# EAGLE design Noctua (EAGLE 9.6.1)
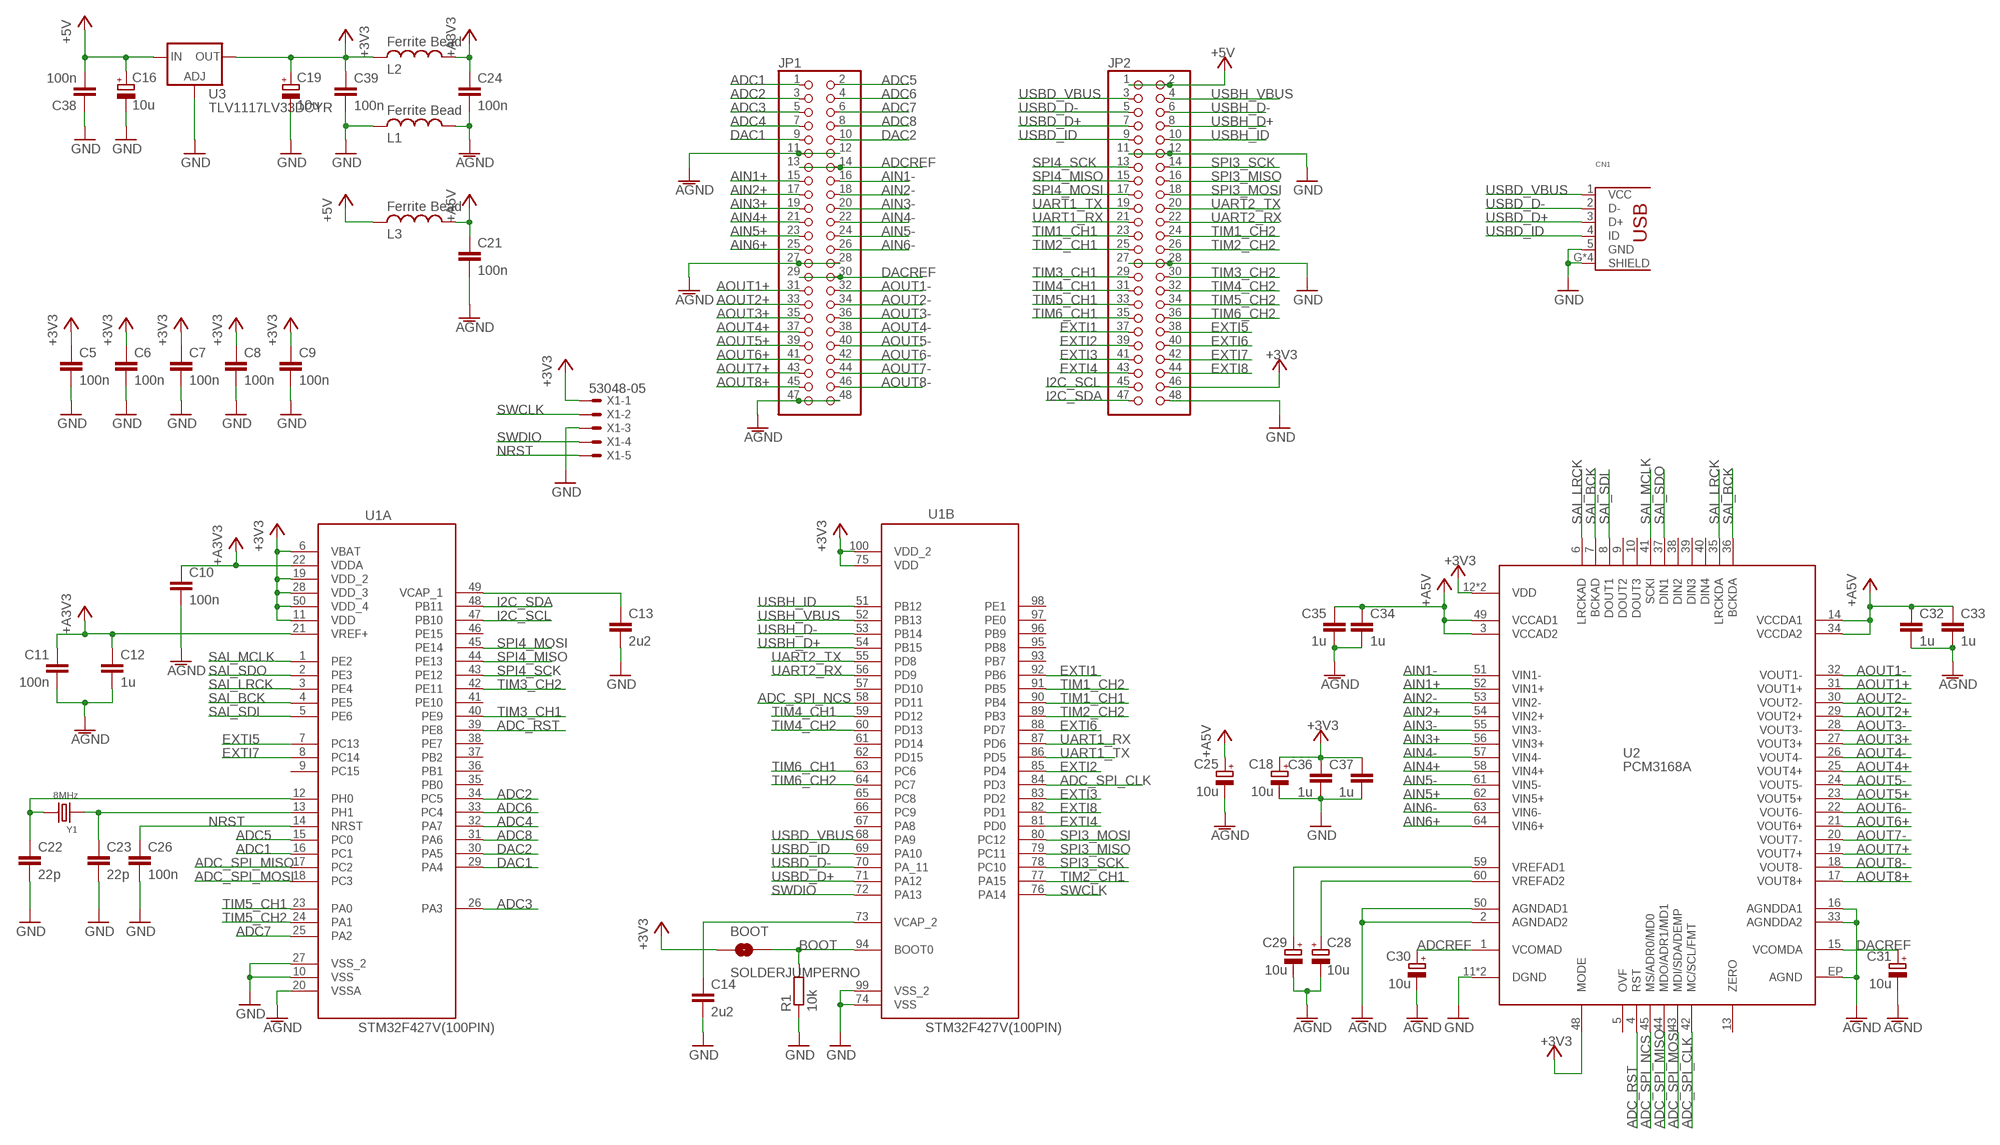
[diagram p0: schematic, sheet 1]

## Parts
BOOT  SOLDERJUMPERNO  [SJ_2S-NO]
C5  100n  C-EUC0603  [C0603]
C6  100n  C-EUC0603  [C0603]
C7  100n  C-EUC0603  [C0603]
C8  100n  C-EUC0603  [C0603]
C9  100n  C-EUC0603  [C0603]
C10  100n  C-EUC0603  [C0603]
C11  100n  C-EUC0603  [C0603]
C12  1u  C-EUC0603  [C0603]
C13  2u2  C-EUC0603  [C0603]
C14  2u2  C-EUC0603  [C0603]
C16  10u  CPOL-EUUD-4X5,8  [UD-4X5,8_NICHICON]
C18  10u  CPOL-EUUD-4X5,8  [UD-4X5,8_NICHICON]
C19  10u  CPOL-EUUD-4X5,8  [UD-4X5,8_NICHICON]
C21  100n  C-EUC0603  [C0603]
C22  22p  C-EUC0603  [C0603]
C23  22p  C-EUC0603  [C0603]
C24  100n  C-EUC0603  [C0603]
C25  10u  CPOL-EUUD-4X5,8  [UD-4X5,8_NICHICON]
C26  100n  C-EUC0603  [C0603]
C28  10u  CPOL-EUUD-4X5,8  [UD-4X5,8_NICHICON]
C29  10u  CPOL-EUUD-4X5,8  [UD-4X5,8_NICHICON]
C30  10u  CPOL-EUUD-4X5,8  [UD-4X5,8_NICHICON]
C31  10u  CPOL-EUUD-4X5,8  [UD-4X5,8_NICHICON]
C32  1u  C-EUC0603  [C0603]
C33  1u  C-EUC0603  [C0603]
C34  1u  C-EUC0603  [C0603]
C35  1u  C-EUC0603  [C0603]
C36  1u  C-EUC0603  [C0603]
C37  1u  C-EUC0603  [C0603]
C38  100n  C-EUC0603  [C0603]
C39  100n  C-EUC0603  [C0603]
CN1  USB_HRS_ZX62-B-5PA(11)MICRO.B  [HRS_ZX62RD-AB-5P8]
JP1  PINHD-2X24  [2X24]
JP2  PINHD-2X24  [2X24]
L1  Ferrite Bead  INDUCTOR  [0603]
L2  Ferrite Bead  INDUCTOR  [0603]
L3  Ferrite Bead  INDUCTOR  [0603]
R1  10k  R-EU_0603  [0603@1]
U1  STM32F427V(100PIN)  STM32F42XV/43XV(100PIN)  [QFP50P1600X1600X160-100N]
U2  PCM3168A  [PQFP64]
U3  TLV1117LV33DCYR  LD117AS33TR  [SOT223]
X1  53048-05  [53048-05]
Y1  8MHz  SMD-CRYSTAL-8MHZ-20PF-20PPM(2P-5.0X3.2MM)  [X2-SMD-5.0X3.2X1.3MM]

## Nets
+3V3: BOOT.1 C5.1 C6.1 C7.1 C8.1 C9.1 C18.+ C19.+ C36.1 C37.1 C39.1 JP2.46 L2.2 U1.6(A:VBAT) U1.11(A:VDD) U1.19(A:VDD_2) U1.28(A:VDD_3) U1.50(A:VDD_4) U1.75(B:VDD) U1.100(B:VDD_2) U2.12(VDD) U2.46(VDD) U2.48(MODE) U3.4(OUT) X1.1
+5V: C16.+ C38.2 JP2.1 JP2.2 L3.2 U3.3(IN)
+A3V3: C10.1 C11.1 C12.1 C24.1 L2.1 U1.21(A:VREF+) U1.22(A:VDDA)
+A5V: C21.1 C25.+ C32.1 C33.1 C34.1 C35.1 L3.1 U2.3(VCCAD2) U2.14(VCCDA1) U2.34(VCCDA2) U2.49(VCCAD1)
ADC1: JP1.1 U1.16(A:PC1)
ADC2: JP1.3 U1.34(A:PC5)
ADC3: JP1.5 U1.26(A:PA3)
ADC4: JP1.7 U1.32(A:PA7)
ADC5: JP1.2 U1.15(A:PC0)
ADC6: JP1.4 U1.33(A:PC4)
ADC7: JP1.6 U1.25(A:PA2)
ADC8: JP1.8 U1.31(A:PA6)
ADC_RST: U1.39(A:PE8) U2.4(RST)
ADC_SPI_CLK: U1.84(B:PD3) U2.42(MC/SCL/FMT)
ADC_SPI_MISO: U1.17(A:PC2) U2.44(MDO/ADR1/MD1)
ADC_SPI_MOSI: U1.18(A:PC3) U2.43(MDI/SDA/DEMP)
ADC_SPI_NCS: U1.58(B:PD11) U2.45(MS/ADR0/MD0)
ADCREF: C30.+ JP1.13 JP1.14 U2.1(VCOMAD)
AGND: C10.2 C11.2 C12.2 C21.2 C24.2 C25.- C28.- C29.- C30.- C31.- C32.2 C33.2 C34.2 C35.2 JP1.11 JP1.12 JP1.27 JP1.28 JP1.47 JP1.48 L1.1 U1.20(A:VSSA) U2.2(AGNDAD2) U2.16(AGNDDA1) U2.33(AGNDDA2) U2.50(AGNDAD1) U2.EP(AGND)
AIN1+: JP1.15 U2.52(VIN1+)
AIN1-: JP1.16 U2.51(VIN1-)
AIN2+: JP1.17 U2.54(VIN2+)
AIN2-: JP1.18 U2.53(VIN2-)
AIN3+: JP1.19 U2.56(VIN3+)
AIN3-: JP1.20 U2.55(VIN3-)
AIN4+: JP1.21 U2.58(VIN4+)
AIN4-: JP1.22 U2.57(VIN4-)
AIN5+: JP1.23 U2.62(VIN5+)
AIN5-: JP1.24 U2.61(VIN5-)
AIN6+: JP1.25 U2.64(VIN6+)
AIN6-: JP1.26 U2.63(VIN6-)
AOUT1+: JP1.31 U2.31(VOUT1+)
AOUT1-: JP1.32 U2.32(VOUT1-)
AOUT2+: JP1.33 U2.29(VOUT2+)
AOUT2-: JP1.34 U2.30(VOUT2-)
AOUT3+: JP1.35 U2.27(VOUT3+)
AOUT3-: JP1.36 U2.28(VOUT3-)
AOUT4+: JP1.37 U2.25(VOUT4+)
AOUT4-: JP1.38 U2.26(VOUT4-)
AOUT5+: JP1.39 U2.23(VOUT5+)
AOUT5-: JP1.40 U2.24(VOUT5-)
AOUT6+: JP1.41 U2.21(VOUT6+)
AOUT6-: JP1.42 U2.22(VOUT6-)
AOUT7+: JP1.43 U2.19(VOUT7+)
AOUT7-: JP1.44 U2.20(VOUT7-)
AOUT8+: JP1.45 U2.17(VOUT8+)
AOUT8-: JP1.46 U2.18(VOUT8-)
BOOT: BOOT.2 R1.2 U1.94(B:BOOT0)
DAC1: JP1.9 U1.29(A:PA4)
DAC2: JP1.10 U1.30(A:PA5)
DACREF: C31.+ JP1.29 JP1.30 U2.15(VCOMDA)
EXTI1: JP2.37 U1.92(B:PB6)
EXTI2: JP2.39 U1.85(B:PD4)
EXTI3: JP2.41 U1.83(B:PD2)
EXTI4: JP2.43 U1.81(B:PD0)
EXTI5: JP2.38 U1.7(A:PC13)
EXTI6: JP2.40 U1.88(B:PD7)
EXTI7: JP2.42 U1.8(A:PC14)
EXTI8: JP2.44 U1.82(B:PD1)
GND: C5.2 C6.2 C7.2 C8.2 C9.2 C13.2 C14.2 C16.- C18.- C19.- C22.2 C23.2 C26.2 C36.2 C37.2 C38.1 C39.2 CN1.5(GND) CN1.G2(SHIELD) CN1.G3(SHIELD) CN1.G4(SHIELD) CN1.G(SHIELD) JP2.11 JP2.12 JP2.27 JP2.28 JP2.48 L1.2 R1.1 U1.10(A:VSS) U1.27(A:VSS_2) U1.74(B:VSS) U1.99(B:VSS_2) U2.11(DGND) U2.47(DGND) U3.1(ADJ) X1.3
I2C_SCL: JP2.45 U1.47(A:PB10)
I2C_SDA: JP2.47 U1.48(A:PB11)
N$2: C28.+ U2.60(VREFAD2)
N$11: C13.1 U1.49(A:VCAP_1)
N$12: C23.1 U1.13(A:PH1) Y1.1
N$15: C22.1 U1.12(A:PH0) Y1.2
N$17: C14.1 U1.73(B:VCAP_2)
NRST: C26.1 U1.14(A:NRST) X1.5
SAI_BCK: U1.4(A:PE5) U2.7(BCKAD) U2.36(BCKDA)
SAI_LRCK: U1.3(A:PE4) U2.6(LRCKAD) U2.35(LRCKDA)
SAI_MCLK: U1.1(A:PE2) U2.41(SCKI)
SAI_SDI: U1.5(A:PE6) U2.8(DOUT1)
SAI_SDO: U1.2(A:PE3) U2.37(DIN1)
SPI3_MISO: JP2.16 U1.79(B:PC11)
SPI3_MOSI: JP2.18 U1.80(B:PC12)
SPI3_SCK: JP2.14 U1.78(B:PC10)
SPI4_MISO: JP2.15 U1.44(A:PE13)
SPI4_MOSI: JP2.17 U1.45(A:PE14)
SPI4_SCK: JP2.13 U1.43(A:PE12)
SWCLK: U1.76(B:PA14) X1.2
SWDIO: U1.72(B:PA13) X1.4
TIM1_CH1: JP2.23 U1.90(B:PB4)
TIM1_CH2: JP2.24 U1.91(B:PB5)
TIM2_CH1: JP2.25 U1.77(B:PA15)
TIM2_CH2: JP2.26 U1.89(B:PB3)
TIM3_CH1: JP2.29 U1.40(A:PE9)
TIM3_CH2: JP2.30 U1.42(A:PE11)
TIM4_CH1: JP2.31 U1.59(B:PD12)
TIM4_CH2: JP2.32 U1.60(B:PD13)
TIM5_CH1: JP2.33 U1.23(A:PA0)
TIM5_CH2: JP2.34 U1.24(A:PA1)
TIM6_CH1: JP2.35 U1.63(B:PC6)
TIM6_CH2: JP2.36 U1.64(B:PC7)
UART1_RX: JP2.21 U1.87(B:PD6)
UART1_TX: JP2.19 U1.86(B:PD5)
UART2_RX: JP2.22 U1.56(B:PD9)
UART2_TX: JP2.20 U1.55(B:PD8)
USBD_D+: CN1.3(D+) JP2.7 U1.71(B:PA12)
USBD_D-: CN1.2(D-) JP2.5 U1.70(B:PA_11)
USBD_ID: CN1.4(ID) JP2.9 U1.69(B:PA10)
USBD_VBUS: CN1.1(VCC) JP2.3 U1.68(B:PA9)
USBH_D+: JP2.8 U1.54(B:PB15)
USBH_D-: JP2.6 U1.53(B:PB14)
USBH_ID: JP2.10 U1.51(B:PB12)
USBH_VBUS: JP2.4 U1.52(B:PB13)
VREF_ADC: C29.+ U2.59(VREFAD1)
Unconnected: U1.9(A:PC15) U1.35(A:PB0) U1.36(A:PB1) U1.37(A:PB2) U1.38(A:PE7) U1.41(A:PE10) U1.46(A:PE15) U1.57(B:PD10) U1.61(B:PD14) U1.62(B:PD15) U1.65(B:PC8) U1.66(B:PC9) U1.67(B:PA8) U1.93(B:PB7) U1.95(B:PB8) U1.96(B:PB9) U1.97(B:PE0) U1.98(B:PE1) U2.5(OVF) U2.9(DOUT2) U2.10(DOUT3) U2.13(ZERO) U2.38(DIN2) U2.39(DIN3) U2.40(DIN4)

## Library data of the parts
BOOT = SparkFun:SOLDERJUMPER: Solder Jumper Standard SMD solder jumper. Used to automate production. Two varients : Normally Open and Normally Closed are the same, but have different paste layers. NC will have a large amount of paste and should jumper during reflow.
C5-C14 C21-C24 C26 C32-C39 = Rebel:C-EU: CAPACITOR, European symbol
C16 C18 C19 C25 C28-C31 = Rebel:CPOL-EU: POLARIZED CAPACITOR, European symbol
CN1 = Rebel:USB_HRS_ZX62-B-5PA(11)MICRO.B
JP1 JP2 = pinhead:PINHD-2X24: PIN HEADER
L1-L3 = Rebel:INDUCTOR; OC_FARNELL: 2288736
R1 = Rebel:R-EU_: RESISTOR, European symbol
U1 = Rebel:STM32F42XV/43XV(100PIN): STM32F746VGT6
U2 = Rebel:PCM3168A
U3 = v-reg:LD117A?*: Low drop fixed and adjustable positive voltage regulators 1 A Source: http://www.st.com/stonline/products/literature/ds/7194/ld1117axx.pdf
X1 = con-molex:53?-05: CONNECTOR wire to board 1.25 mm (.049 inch) pitch header; MF: MOLEX; MPN: 53048-0510; OC_FARNELL: 9732926; OC_NEWARK: 57H4722
Y1 = Seeed-OPL-crystal-osctllator:SMD-CRYSTAL-8MHZ-20PF-20PPM(2P-5.0X3.2MM): 306010004; MPN: 5032/2P; VALUE: 5032/2p

## Net classes
1 power: width 0.178 mm, drill 0.305 mm, clearance 0.178 mm to class 0, clearance 0.178 mm

## Board
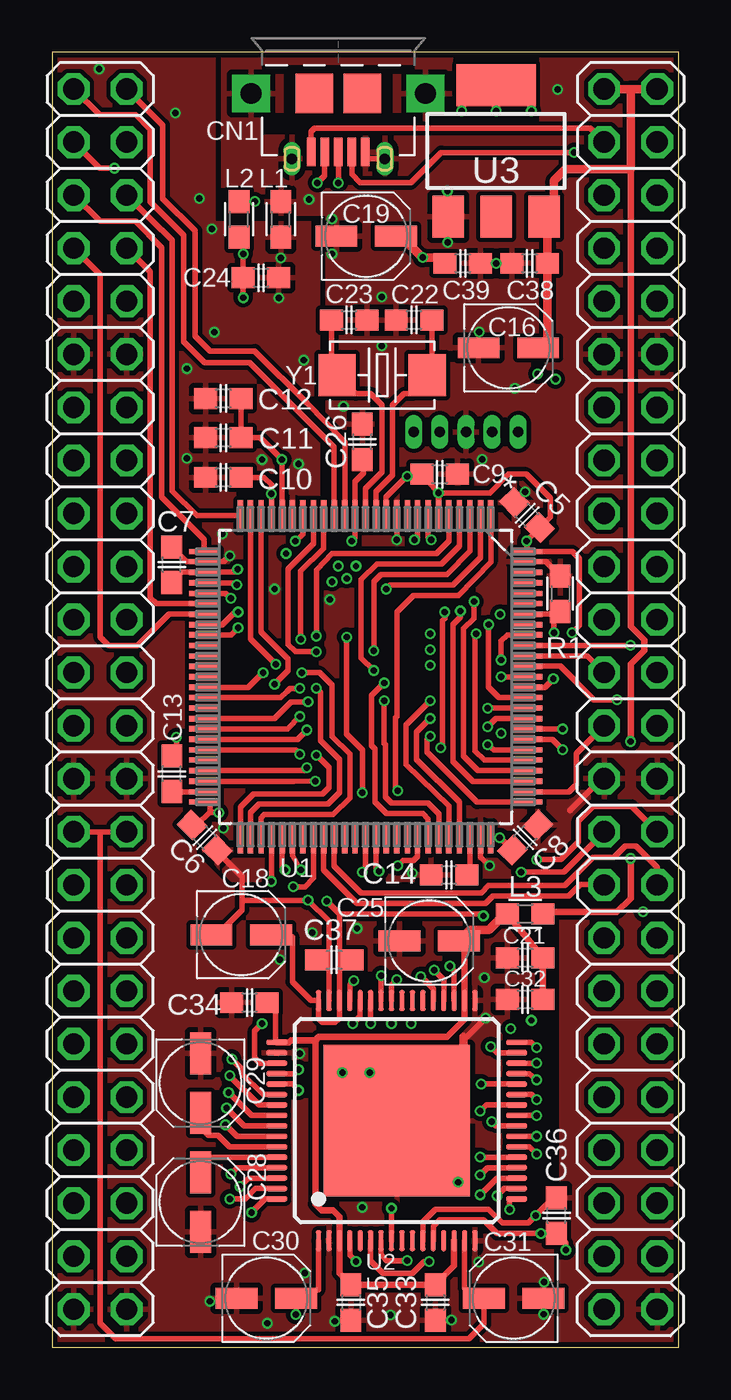
[diagram p1: board, top side]
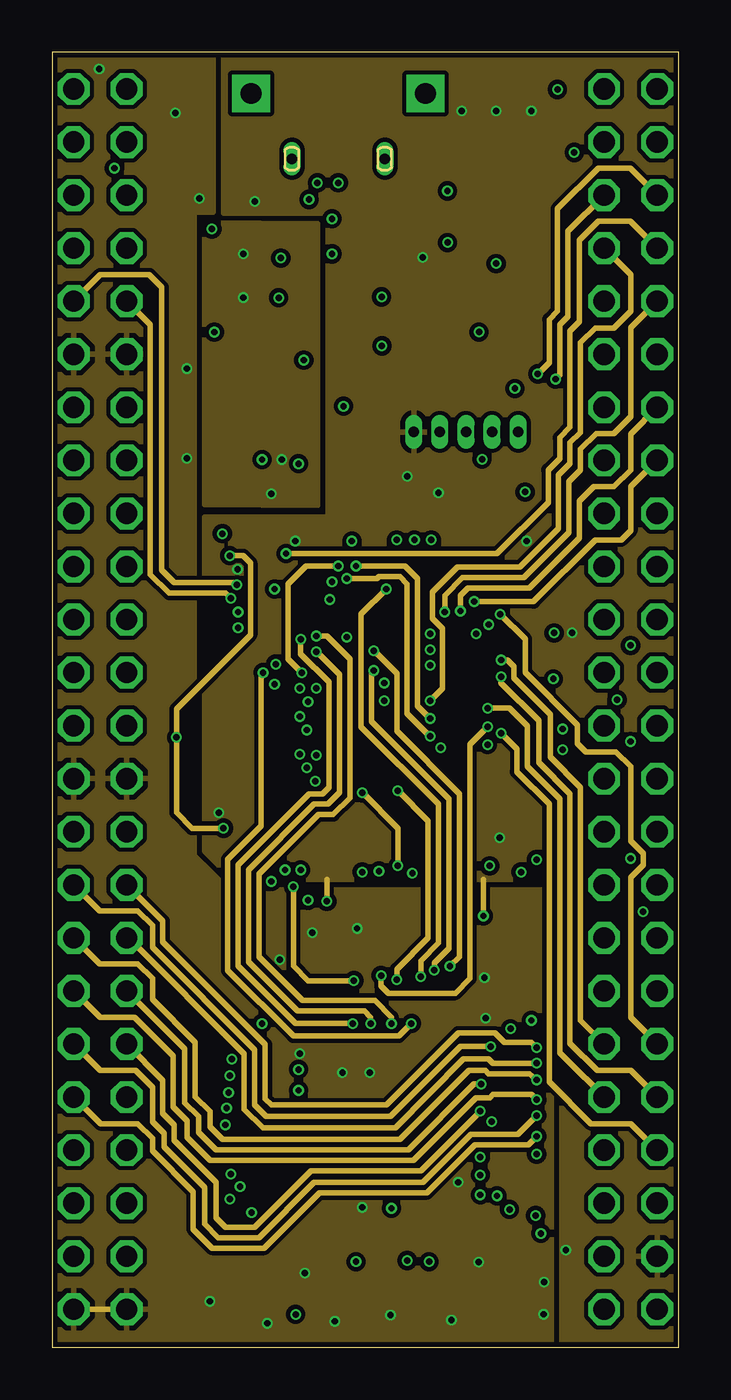
[diagram p2: board, inner layer InnerTop]
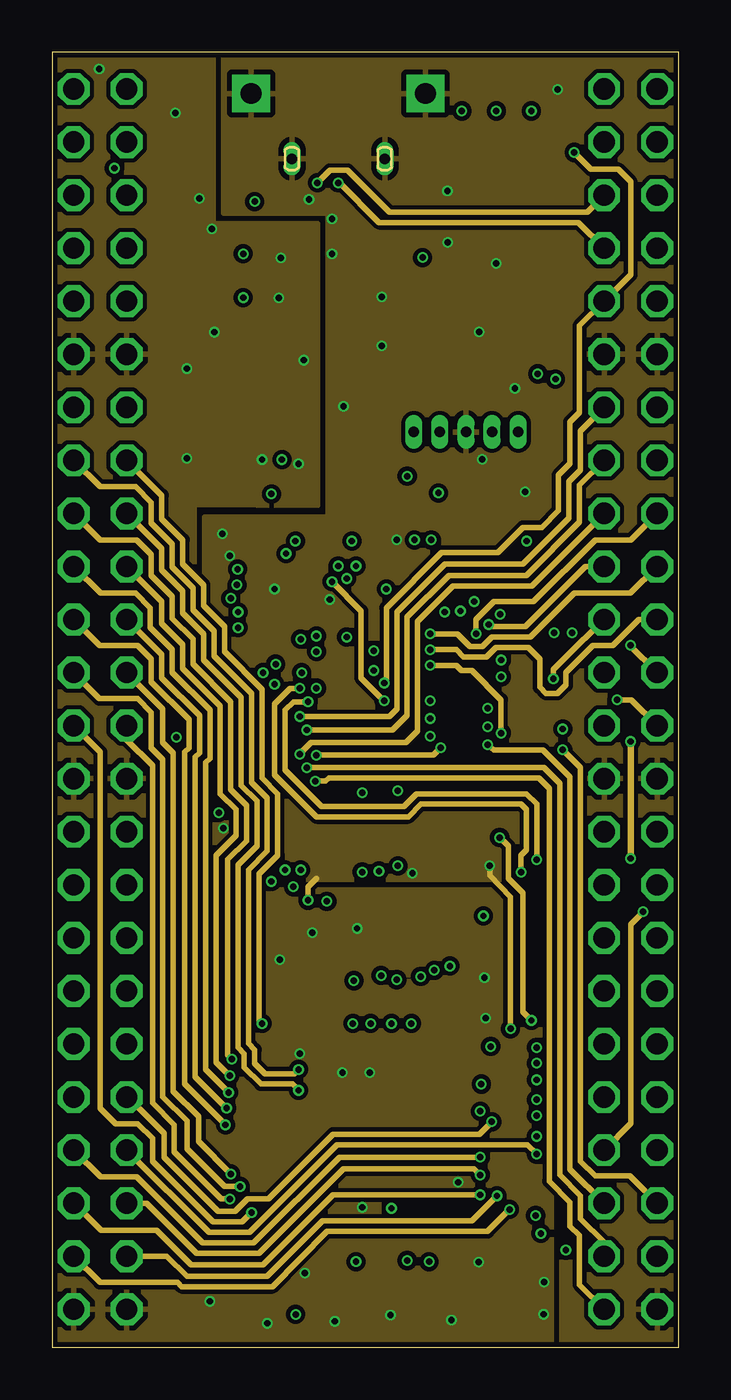
[diagram p3: board, inner layer InnerBottom]
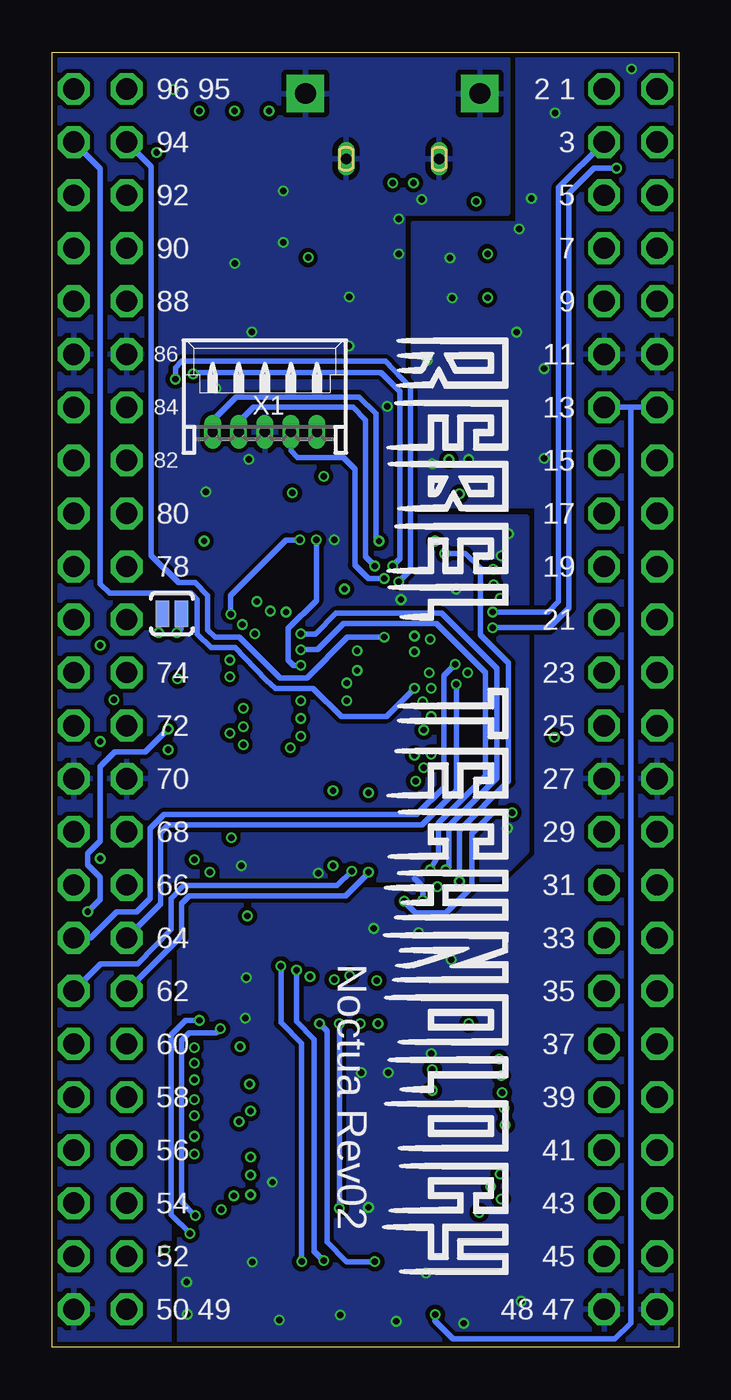
[diagram p4: board, bottom side, seen from below]

Size 30 x 62 mm. Coordinates in mm from the lower left corner, seen from the top.
Outline: 0,0 30,0 30,62 0,62 0,0
Copper layers (1*2*15*16): Top 0.035mm / dielectric 0.2mm / InnerTop 0.0175mm / dielectric 0.3mm / InnerBottom 0.0175mm / dielectric 0.2mm / Bottom 0.035mm
Design rules "SeeedStudio_4layer_DRU_no_angle_20140221 *": minimum track width 8mil, minimum drill 12mil, track to track 8mil, track to pad 8mil, pad to pad 8mil, via to via 8mil, smd to smd 0mil, copper to edge 10mil, drill to drill 8mil, minimum pad ring 6mil, minimum via ring 4mil, stop-mask expansion 4mil, vias tented up to drill 25mil, thermal gap 10mil

### Footprints (pad centres in the part's own frame; a part is rotated, then mirrored left to right if it is on the bottom)
SJ_2S-NO = smd 0.635 x 1.27: 1 -0.45,0; 2 0.45,0
C0603 = smd 1.1 x 1: 1 -0.85,0; 2 0.85,0
UD-4X5,8_NICHICON = smd 2 x 1: + 1.425,0; - -1.425,0
HRS_ZX62RD-AB-5P8 = smd 0.4 x 1.35: 1 1.3,2.275; 2 0.65,2.275; 3 0,2.275; 4 -0.65,2.275; 5 -1.3,2.275 | smd 1.8 x 1.9: D_0 -1.15,-0.525; D_1 1.15,-0.525 | drill 1 pad 1.8 square: G -4.175,-0.525; G2 4.175,-0.525 | drill 0.5 long: G3 -2.225,2.6; G4 2.225,2.6
2X24 = drill 1.016 octagon: 1 -27.94,-1.27; 2 -27.94,1.27; 3 -25.4,-1.27; 4 -25.4,1.27; 5 -22.86,-1.27; 6 -22.86,1.27; 7 -20.32,-1.27; 8 -20.32,1.27; 9 -17.78,-1.27; 10 -17.78,1.27; 11 -15.24,-1.27; 12 -15.24,1.27; 13 -12.7,-1.27; 14 -12.7,1.27; 15 -10.16,-1.27; 16 -10.16,1.27; 17 -7.62,-1.27; 18 -7.62,1.27; 19 -5.08,-1.27; 20 -5.08,1.27; 21 -2.54,-1.27; 22 -2.54,1.27; 23 0,-1.27; 24 0,1.27; 25 2.54,-1.27; 26 2.54,1.27; 27 5.08,-1.27; 28 5.08,1.27; 29 7.62,-1.27; 30 7.62,1.27; 31 10.16,-1.27; 32 10.16,1.27; 33 12.7,-1.27; 34 12.7,1.27; 35 15.24,-1.27; 36 15.24,1.27; 37 17.78,-1.27; 38 17.78,1.27; 39 20.32,-1.27; 40 20.32,1.27; 41 22.86,-1.27; 42 22.86,1.27; 43 25.4,-1.27; 44 25.4,1.27; 45 27.94,-1.27; 46 27.94,1.27; 47 30.48,-1.27; 48 30.48,1.27
0603 = smd 1.1 x 1: 1 -0.85,0; 2 0.85,0
0603@1 = smd 1.1 x 1: 1 -0.85,0; 2 0.85,0
QFP50P1600X1600X160-100N = smd 1.473 x 0.254: 1 -7.722,5.994; 2 -7.722,5.512; 3 -7.722,5.004; 4 -7.722,4.496; 5 -7.722,3.988; 6 -7.722,3.505; 7 -7.722,2.997; 8 -7.722,2.489; 9 -7.722,2.007; 10 -7.722,1.499; 11 -7.722,0.991; 12 -7.722,0.508; 13 -7.722,0; 14 -7.722,-0.508; 15 -7.722,-0.991; 16 -7.722,-1.499; 17 -7.722,-2.007; 18 -7.722,-2.489; 19 -7.722,-2.997; 20 -7.722,-3.505; 21 -7.722,-3.988; 22 -7.722,-4.496; 23 -7.722,-5.004; 24 -7.722,-5.512; 25 -7.722,-5.994; 51 7.722,-5.994; 52 7.722,-5.512; 53 7.722,-5.004; 54 7.722,-4.496; 55 7.722,-3.988; 56 7.722,-3.505; 57 7.722,-2.997; 58 7.722,-2.489; 59 7.722,-2.007; 60 7.722,-1.499; 61 7.722,-0.991; 62 7.722,-0.508; 63 7.722,0; 64 7.722,0.508; 65 7.722,0.991; 66 7.722,1.499; 67 7.722,2.007; 68 7.722,2.489; 69 7.722,2.997; 70 7.722,3.505; 71 7.722,3.988; 72 7.722,4.496; 73 7.722,5.004; 74 7.722,5.512; 75 7.722,5.994 | smd 0.254 x 1.473: 26 -5.994,-7.722; 27 -5.512,-7.722; 28 -5.004,-7.722; 29 -4.496,-7.722; 30 -3.988,-7.722; 31 -3.505,-7.722; 32 -2.997,-7.722; 33 -2.489,-7.722; 34 -2.007,-7.722; 35 -1.499,-7.722; 36 -0.991,-7.722; 37 -0.508,-7.722; 38 0,-7.722; 39 0.508,-7.722; 40 0.991,-7.722; 41 1.499,-7.722; 42 2.007,-7.722; 43 2.489,-7.722; 44 2.997,-7.722; 45 3.505,-7.722; 46 3.988,-7.722; 47 4.496,-7.722; 48 5.004,-7.722; 49 5.512,-7.722; 50 5.994,-7.722; 76 5.994,7.722; 77 5.512,7.722; 78 5.004,7.722; 79 4.496,7.722; 80 3.988,7.722; 81 3.505,7.722; 82 2.997,7.722; 83 2.489,7.722; 84 2.007,7.722; 85 1.499,7.722; 86 0.991,7.722; 87 0.508,7.722; 88 0,7.722; 89 -0.508,7.722; 90 -0.991,7.722; 91 -1.499,7.722; 92 -2.007,7.722; 93 -2.489,7.722; 94 -2.997,7.722; 95 -3.505,7.722; 96 -3.988,7.722; 97 -4.496,7.722; 98 -5.004,7.722; 99 -5.512,7.722; 100 -5.994,7.722
PQFP64 = smd 0.25 x 1: 1 -3.75,-5.75; 2 -3.25,-5.75; 3 -2.75,-5.75; 4 -2.25,-5.75; 5 -1.75,-5.75; 6 -1.25,-5.75; 7 -0.75,-5.75; 8 -0.25,-5.75; 9 0.25,-5.75; 10 0.75,-5.75; 11 1.25,-5.75; 12 1.75,-5.75; 13 2.25,-5.75; 14 2.75,-5.75; 15 3.25,-5.75; 16 3.75,-5.75; 33 3.75,5.75; 34 3.25,5.75; 35 2.75,5.75; 36 2.25,5.75; 37 1.75,5.75; 38 1.25,5.75; 39 0.75,5.75; 40 0.25,5.75; 41 -0.25,5.75; 42 -0.75,5.75; 43 -1.25,5.75; 44 -1.75,5.75; 45 -2.25,5.75; 46 -2.75,5.75; 47 -3.25,5.75; 48 -3.75,5.75 | smd 1 x 0.25: 17 5.75,-3.75; 18 5.75,-3.25; 19 5.75,-2.75; 20 5.75,-2.25; 21 5.75,-1.75; 22 5.75,-1.25; 23 5.75,-0.75; 24 5.75,-0.25; 25 5.75,0.25; 26 5.75,0.75; 27 5.75,1.25; 28 5.75,1.75; 29 5.75,2.25; 30 5.75,2.75; 31 5.75,3.25; 32 5.75,3.75; 49 -5.75,3.75; 50 -5.75,3.25; 51 -5.75,2.75; 52 -5.75,2.25; 53 -5.75,1.75; 54 -5.75,1.25; 55 -5.75,0.75; 56 -5.75,0.25; 57 -5.75,-0.25; 58 -5.75,-0.75; 59 -5.75,-1.25; 60 -5.75,-1.75; 61 -5.75,-2.25; 62 -5.75,-2.75; 63 -5.75,-3.25; 64 -5.75,-3.75 | smd 7 x 7.26: EP 0,0
SOT223 = smd 1.5 x 2: 1 -2.3,-3.15; 2 0,-3.15; 3 2.3,-3.15 | smd 3.8 x 2: 4 0,3.15
53048-05 = drill 0.5 pad 0.698 long: 1 2.5,-1.25; 2 1.25,-1.25; 3 0,-1.25; 4 -1.25,-1.25; 5 -2.5,-1.25
X2-SMD-5.0X3.2X1.3MM = smd 1.778 x 2.032: 1 -2.159,0; 2 2.159,0

### Placement (x,y rotation side)
BOOT  24.27,35.12 0 bottom
C5  22.73,39.84 135 top
C6  7.3,24.4 315 top
C7  5.73,37.47 90 top
C8  22.65,24.4 45 top
C9  18.55,41.8 0 top
C10  8.2,41.65 180 top
C11  8.2,43.54 180 top
C12  8.2,45.42 180 top
C13  5.73,27.45 90 top
C14  19,22.61 180 top
C16  21.84,47.85 0 top
C18  9.05,19.75 0 top
C19  15.03,53.19 0 top
C21  22.65,18.65 180 top
C22  17.32,49.18 180 top
C23  14.21,49.18 0 top
C24  10,51.2 0 top
C25  18.05,19.45 0 top
C26  14.85,43.35 90 top
C28  7.1,6.95 90 top
C29  7.1,12.65 270 top
C30  10.25,2.35 0 top
C31  22.1,2.35 180 top
C32  22.65,16.65 180 top
C33  18.35,2.15 270 top
C34  9.45,16.5 180 top
C35  14.3,2.15 270 top
C36  24.15,6.3 90 top
C37  13.5,18.55 180 top
C38  22.87,51.89 0 top
C39  19.67,51.89 0 top
CN1  13.7,59.5 180 top
JP1  2.3,32.3 270 top
JP2  27.7,32.3 270 top
L1  10.95,54 90 top
L2  8.95,54 90 top
L3  22.65,20.75 0 top
R1  24.32,36.08 270 top
U1  15,32.1 270 top
U2  16.5,10.85 0 top
U3  21.26,57.28 0 top
X1  19.82,45.08 0 bottom
Y1  15.8,46.54 0 top

### Tracks (layer width: path | path; a pad name or v marks a point on that pad's centre or on a via)
+3V3  (via drill 0.3)
  Top 0.254: U1.50 7.55,26.1 7.55,25.62 | U1.75 21.45,24.38 | C8.1 21.47,24.38 21.45,24.38 | C7.1 6.19,37.1 U1.28 8.73,37.1 v8.88,37.25 | 21.45,24.38 arc-90 v21.43,24.4 | U1.19 12.01,38.94 v11.65,38.6 | 7.55,25.62 6.93,25 C6.1 | U2.12 18.25,5.8 18.55,6.1 20.65,6.1 21.3,5.45 v23.4,5.45 C36.1 24.6,5 v24.6,4.65 | U1.11 16,40.7 v17,41.7 C9.1 v18.5,40.9 | v7.98,25.6 7.58,25.6 7.55,25.62 | 13.75,18.55 U2.46 13.75,15.75 13.55,15.55 12.95,15.55 12.75,15.75 U2.48 12.4,16.6 11.5,17.5 11.5,19.65 10.75,19.65 C18.+ | C37.1 13.75,18.55 | 13.75,18.55 13.75,20.75 | 13.75,20.75 v13.15,21.35 | v18.5,40.9 v18.51,40.89 U1.6 18.5,39.83 v18.5,40.9 | L2.2 v9.7,54.85 | v24.9,34.2 25.25,34.55 25.25,37.75 24.91,38.09 U1.100 v22.73,38.6 22.73,38.63 C5.1 23.85,39.75 23.85,40.65 22.7,41.8 21.85,41.8 20.95,40.9 v18.5,40.9 | 13.75,20.75 20.55,20.75 v20.65,20.65
  Top 0.406: v22.95,59.19 22.95,59.73 22.25,60.43 U3.4 | U3.4 20.15,60.43 19.61,59.89 v19.61,59.19 | v21.26,59.19 U3.4 | C39.1 18.82,52.17 v17.74,52.17 16.75,53.16 16.75,53.19 C19.+
  InnerTop 0.254: v20.65,20.65 20.65,22.4 | v13.15,21.35 13.15,22.4
  InnerBottom 0.254: v21.43,24.4 21.45,24.4 21.85,24 21.85,22.45 22.55,21.75 22.55,16.05 v22.95,15.65
  Bottom 0.254: v24.9,34.2 24.9,35.07 BOOT.1 | v22.95,15.65 23.6,15.65 24.3,14.95 24.3,6.35 v23.4,5.45 | v7.98,25.6 8.9,25.6 9.9,24.6 9.9,22.05 11.15,20.8 12.6,20.8 v13.15,21.35
  pour InnerTop: 8.2,62 30.5,62 30.5,0 24.4,0 24.4,22.4 8.65,22.4 7.3,23.75 7.3,39.75 13.2,39.75 13.2,54.3 8.2,54.3
+5V  (via drill 0.3)
  Top 0.254: L3.2 23.5,20.85
  Top 0.305: 23.5,20.85 27.05,20.85 27.7,21.5 v27.7,23.4 | v27.7,29 27.7,32.7 28.35,33.35 28.35,33.85 27.7,34.5 27.7,59.89
  Top 0.406: JP2.1 27.69,60.24 27.7,60.23 | JP2.2 27.71,60.24 27.7,60.23 | 27.7,60.23 27.7,59.89 27.7,56.4 24.58,56.4 24.03,55.85 24.03,54.21 23.64,54.21 U3.3 23.72,53.97 C38.2 23.7,51.88 23.7,48.28 C16.+
  InnerBottom 0.305: v27.7,23.4 v27.7,29
+A3V3  (via drill 0.3)
  Top 0.254: U1.22 v10.51,40.86 v10.5,40.85 10.5,41.3 10.15,41.65 C10.1 | C12.1 C11.1 9.96,43.54 v11,42.5 11.02,42.43 U1.21 | v9.15,50.25 C24.1 | L2.1 9.15,53.15 v9.15,52.35 9.15,51.35
  pour InnerTop: 7.3,53.85 12.7,53.8 12.7,40.3 7.3,40.35
+A5V
  Top 0.254: 19.75,19.15 C25.+ | U2.49 10.7,14.6 10.7,16.15 C34.1
  Top 0.305: U2.14 19.25,3.9 C33.1 C35.1 13.75,3.55 U2.3 13.75,6.25 13.45,6.55 12.9,6.55 12.6,6.85 12.6,14.7 | 19.75,19.15 U2.34 19.75,15.7 18.9,14.85 12.75,14.85 12.6,14.7 | C32.1 C21.1 L3.1 | 12.6,14.7 11.45,14.7 11.35,14.6 U2.49
  Top 0.406: C25.+ 20.02,19.99 20.92,19.99 21.68,20.75 L3.1
ADC1
  Top 0.254: JP1.1 2.27,59 4,59 4.7,58.3 4.7,54.85 6.3,53.25 6.3,48.15 7.3,47.15 9.45,47.15 13.51,43.09 U1.16
ADC2  (via drill 0.3)
  Top 0.254: U1.34 8.56,34.11 v8.9,34.45 | v2.98,56.45 2.28,56.45 JP1.3
  Bottom 0.254: v2.98,56.45 4.05,56.45 5.25,55.25 5.25,35.4 6.2,34.45 v8.9,34.45
ADC3
  Top 0.254: JP1.5 2.29,53.9 4,53.9 5.25,52.65 5.25,40.7 7.28,38.67 U1.26
ADC4
  Top 0.254: JP1.7 2.3,51.35 2.3,34 2.7,33.6 4.1,33.6 5.6,35.1 U1.32
ADC5
  Top 0.254: U1.15 14.01,43.34 12.2,45.2 9.7,47.7 7.55,47.7 6.85,48.4 6.85,53.45 5.3,55 5.3,58.51 JP1.2
ADC6  (via drill 0.3)
  Top 0.254: U1.33 8.14,34.59 8.75,35.2 v8.9,35.2
  Bottom 0.254: v8.9,35.2 6.25,35.2 5.75,35.7 5.75,55.52 JP1.4
ADC7
  Top 0.254: U1.25 6.93,39.82 5.75,41 5.75,53 5.25,53.5 5.25,53.48 JP1.6
ADC8
  Top 0.254: JP1.8 4.7,51.49 4.7,35.9 5,35.6 U1.31
ADC_RST  (via drill 0.3)
  Top 0.254: U1.39 9.39,31.59 v10.1,32.3 | U2.4 14.25,4.4 v14.55,4.1
  InnerTop 0.254: v17.2,15.5 16.6,14.9 11.55,14.9 8.4,18.05 8.4,23.35 10,24.95 10,32.2 v10.1,32.3
  Bottom 0.254: v14.55,4.1 15.9,4.1 16.85,5.05 16.85,15.15 v17.2,15.5
ADC_SPI_CLK  (via drill 0.3)
  Top 0.254: U1.84 21.24,30.09 v20.85,29.7 | U2.42 v15.75,17.8
  InnerTop 0.254: v20.85,29.7 20,28.85 20,17.65 19.3,16.95 16.1,16.95 15.75,17.3 v15.75,17.8
ADC_SPI_MISO  (via drill 0.3)
  Top 0.254: U1.17 13,38.25 11.9,37.15 v11.9,33.9 | U2.44 14.75,15.85 v14.4,15.5
  InnerTop 0.254: v11.9,33.9 11.9,33.2 13.25,31.85 13.25,26.8 12.95,26.5 12.3,26.5 8.9,23.1 8.9,18.25 11.65,15.5 v14.4,15.5
ADC_SPI_MOSI  (via drill 0.3)
  Top 0.254: U1.18 12.52,38.47 11.3,37.25 11.3,33.65 11.65,33.3 v12.65,33.3 | v15.25,15.5 U2.43
  InnerTop 0.254: v12.65,33.3 13.75,32.2 13.75,26.55 13.2,26 12.55,26 9.4,22.85 9.4,18.45 11.75,16.1 14.95,16.1 15.25,15.8 v15.25,15.5
ADC_SPI_NCS  (via drill 0.3)
  Top 0.254: U1.58 12.52,22.47 12.1,22.05 v11.55,22.05 | U2.45 14.25,17.35 v14.45,17.55
  InnerTop 0.254: v14.45,17.55 12.25,17.55 11.55,18.25 v11.55,22.05
ADCREF  (via drill 0.3)
  Top 0.254: v11.66,1.58 11.67,1.58 C30.+ 11.99,2.35 12.75,2.74 U2.1
  Bottom 0.254: JP1.13 2.3,45 | JP1.14 2.3,45 | 2.3,45 2.3,1.15 3.05,0.4 10.8,0.4 11.66,1.26 v11.66,1.58
AGND  (via drill 0.3)
  Top 0.254: 19.7,14.85 19.85,14.85 v20.75,15.75 | U2.EP 16.5,11.95 v15.2,13.15
  Top 0.406: 19.7,14.85 19.7,14.3
  InnerTop 0.254: JP1.47 JP1.48
  other vias: 10.05,42.5 11.8,42.3 19.12,1.3 23.56,3.13 23.53,1.58 13.53,1.25 7.54,2.2 10.3,1.15 11.85,14.05 19.45,7.9 20.7,17.7 14.6,20.05 13.9,13.15 6.45,42.55 10.95,52.15 7.76,48.6 12.05,47.26 12.45,19.85 10.9,18.55 7.05,55 5.91,59.08 2.25,61.2 6.45,46.85 10.84,50.24 7.65,53.54 12.1,3.55 16.2,1.55 14.85,6.7 20.42,4.08
  pour Top: -0.2,62 7.7,62 7.7,53.8 12.7,53.8 12.7,40.3 6.8,40.3 6.8,23.55 8.5,21.9 23.9,21.9 23.9,-0.05 -0.5,0 -0.5,27.7 -0.25,42.5
  pour Bottom: -0.2,62 7.7,62 7.7,53.8 12.7,53.8 12.7,40.3 6.8,40.3 6.8,23.55 8.5,21.9 23.9,21.9 23.9,-0.05 -0.5,0 -0.5,27.7 -0.25,42.5
  pour InnerTop: -0.2,62 7.7,62 7.7,54.35 6.8,54.35 6.8,23.55 8.5,21.9 23.9,21.9 23.9,-0.05 -0.5,0 -0.5,27.7 -0.25,42.5
  pour InnerBottom: -0.2,62 7.7,62 7.7,53.8 12.7,53.8 12.7,40.3 6.8,40.35 6.8,23.55 8.5,21.9 23.9,21.9 23.9,-0.05 -0.5,0 -0.5,27.7 -0.25,42.5
AIN1+  (via drill 0.3)
  Top 0.254: U2.52 11.6,13.1 v11.8,13.3
  InnerBottom 0.254: v11.8,13.3 11.6,13.1 10.2,13.1 9.7,13.6 9.7,14.25 9.4,14.55 9.4,22.85 10.3,23.75 10.3,26.3 9.55,27.05 9.55,31.3 7.75,33.1 7.75,34.3 6.75,35.3 6.75,36.35 5.75,37.35 5.75,38.45 4.75,39.45 4.75,40.45 4,41.2 2.29,41.2 JP1.15
AIN1-  (via drill 0.3)
  Top 0.254: U2.51 9.95,13.6 9.7,13.85 9.7,15.15 v10.05,15.5
  InnerBottom 0.254: v10.05,15.5 9.9,15.65 9.9,22.65 10.8,23.55 10.8,26.5 10.05,27.25 10.05,31.5 8.25,33.3 8.25,34.5 7.25,35.5 7.25,36.5 6.25,37.5 6.25,38.65 5.25,39.65 5.25,40.78 JP1.16
AIN2+  (via drill 0.3)
  Top 0.254: U2.54 10.1,12.1 9.1,13.1 9.1,13.3 v8.6,13.8
  InnerBottom 0.254: JP1.17 2.3,38.65 4.05,38.65 4.75,37.95 4.75,36.95 5.75,35.95 5.75,34.9 6.75,33.9 6.75,32.7 8.55,30.9 8.55,26.7 9.3,25.95 9.3,24.25 8.4,23.35 8.4,14 v8.6,13.8
AIN2-  (via drill 0.3)
  Top 0.254: U2.53 11.5,12.6 v11.8,12.3
  InnerBottom 0.254: JP1.18 5.25,38.24 5.25,37.2 6.25,36.2 6.25,35.15 7.25,34.15 7.25,32.9 9.05,31.1 9.05,26.9 9.8,26.15 9.8,24 8.9,23.1 8.9,14.35 9.2,14.05 9.2,13.4 10,12.6 11.5,12.6 v11.8,12.3
AIN3+  (via drill 0.3)
  Top 0.254: U2.56 9.55,11.1 v8.45,12.2
  InnerBottom 0.254: v8.45,12.2 7.35,13.3 7.35,28 7.55,28.2 7.55,30.5 5.75,32.3 5.75,33.4 4.7,34.45 4.7,35.4 4,36.1 2.31,36.1 JP1.19
AIN3-  (via drill 0.3)
  Top 0.254: U2.55 9.9,11.6 v8.5,13
  InnerBottom 0.254: v8.5,13 7.85,13.65 7.85,23.55 8.8,24.5 8.8,25.75 8.05,26.5 8.05,30.7 6.25,32.5 6.25,33.65 5.25,34.65 5.25,35.7 JP1.20
AIN4+  (via drill 0.3)
  Top 0.254: U2.58 8.85,10.1 v8.3,10.65
  InnerBottom 0.254: JP1.21 2.27,33.6 4.1,33.6 4.75,32.95 4.75,31.85 6.55,30.05 6.55,28.7 6.35,28.5 6.35,12.6 v8.3,10.65
AIN4-  (via drill 0.3)
  Top 0.254: U2.57 9.2,10.6 v8.35,11.45
  InnerBottom 0.254: JP1.22 5.25,33.16 5.25,32.05 7.05,30.25 7.05,28.45 6.85,28.25 6.85,12.95 v8.35,11.45
AIN5+  (via drill 0.3)
  Top 0.254: U2.62 9.4,8.1 v9,7.7
  InnerBottom 0.254: JP1.23 1.03,32.27 2.25,31.05 4.1,31.05 4.75,30.4 4.75,28.7 5.3,28.15 5.3,12 6.45,10.85 6.45,9.5 8.25,7.7 v9,7.7
AIN5-  (via drill 0.3)
  Top 0.254: U2.61 8.85,8.6 v8.55,8.3
  InnerBottom 0.254: JP1.24 3.57,32.28 5.3,30.55 5.3,28.95 5.8,28.45 5.8,12.25 7,11.05 7,9.85 v8.55,8.3
AIN6+  (via drill 0.3)
  Top 0.254: U2.64 10.2,7.1 v9.55,6.45
  InnerBottom 0.254: JP1.25 2.3,28.49 2.3,11.45 3.05,10.7 4.1,10.7 4.8,10 4.8,8.9 7.7,6 9.1,6 v9.55,6.45
AIN6-  (via drill 0.3)
  Top 0.254: U2.63 9.75,7.6 9.25,7.1 v8.5,7.1
  InnerBottom 0.254: JP1.26 3.57,29.08 4.8,27.85 4.8,11.7 5.85,10.65 5.85,9.35 8.1,7.1 v8.5,7.1
AOUT1+  (via drill 0.3)
  Top 0.254: U2.31 21.3,14.1 v21,14.4
  InnerTop 0.254: v21,14.4 19.55,14.4 16.2,11.05 10.25,11.05 9.7,11.6 9.7,14.25 4.8,19.15 4.8,20.2 4.1,20.9 2.27,20.9 JP1.31
AOUT1-  (via drill 0.3)
  Top 0.254: v23.2,14.35 22.95,14.6 U2.32
  InnerTop 0.254: JP1.32 5.3,20.41 5.3,19.4 10.2,14.5 10.2,11.9 10.5,11.6 16,11.6 19.45,15.05 21.2,15.05 21.65,14.6 22.95,14.6 v23.2,14.35
AOUT2+  (via drill 0.3)
  Top 0.254: v23.2,12.8 22.85,13.1 U2.29
  InnerTop 0.254: JP1.33 2.28,18.35 4.1,18.35 4.8,17.65 4.8,16.65 6.85,14.6 6.85,12 7.55,11.3 7.55,10.55 8.15,9.95 16.65,9.95 19.95,13.25 20.75,13.25 20.9,13.1 22.85,13.1 v23.2,12.8
AOUT2-  (via drill 0.3)
  Top 0.254: v23.2,13.6 U2.30
  InnerTop 0.254: v23.2,13.6 21.1,13.6 20.9,13.8 19.7,13.8 16.45,10.5 10.1,10.5 9.2,11.4 9.2,14.05 3.65,19.6 JP1.34
AOUT3+  (via drill 0.3)
  Top 0.254: v23.2,11.85 22.95,12.1 U2.27
  InnerTop 0.254: JP1.35 2.29,15.8 3.95,15.8 5.8,13.95 5.8,11.5 6.45,10.85 6.45,10.05 7.55,8.95 17.3,8.95 20.3,11.95 20.95,11.95 21.1,12.1 22.95,12.1 v23.2,11.85
AOUT3-  (via drill 0.3)
  Top 0.254: v20.55,12.6 U2.28
  InnerTop 0.254: JP1.36 6.35,14.28 6.35,11.7 7,11.05 7,10.3 7.85,9.45 17.05,9.45 20.2,12.6 v20.55,12.6
AOUT4+  (via drill 0.3)
  Top 0.254: v23.2,11.1 U2.25
  InnerTop 0.254: JP1.37 2.3,13.25 4,13.25 4.8,12.45 4.8,10.8 5.35,10.25 5.35,9.6 7.3,7.65 7.3,5.9 7.95,5.25 9.9,5.25 12.55,7.9 17.75,7.9 20.05,10.2 22.3,10.2 v23.2,11.1
AOUT4-  (via drill 0.3)
  Top 0.254: v20.5,11.3 20.8,11.6 U2.26
  InnerTop 0.254: JP1.38 5.3,12.79 5.3,11.2 5.85,10.65 5.85,9.9 7.85,7.9 7.85,6.2 8.3,5.75 9.7,5.75 12.4,8.45 17.65,8.45 v20.5,11.3
AOUT5+  (via drill 0.3)
  Top 0.254: v23.2,10.1 U2.23
  InnerTop 0.254: JP1.39 2.31,10.7 4.1,10.7 4.8,10 4.8,9.4 6.75,7.45 6.75,5.65 7.65,4.75 10.15,4.75 12.8,7.4 17.95,7.4 20.25,9.7 22.8,9.7 v23.2,10.1
AOUT5-  (via drill 0.3)
  Top 0.254: U2.24 21.25,10.6 v21.05,10.8
  InnerBottom 0.254: JP1.40 3.62,11.98 5.35,10.25 5.35,9.1 7.95,6.5 8.75,6.5 9.35,7.1 10.35,7.1 13.45,10.2 20.45,10.2 v21.05,10.8
AOUT6+  (via drill 0.3)
  Top 0.254: v20.5,9.1 U2.21
  InnerBottom 0.254: JP1.41 2.32,8.15 4.05,8.15 7.2,5 9.65,5 13.75,9.1 v20.5,9.1
AOUT6-  (via drill 0.3)
  Top 0.254: U2.22 22.85,9.6 v23.2,9.25
  InnerBottom 0.254: JP1.42 7.51,5.5 9.45,5.5 13.65,9.7 22.75,9.7 v23.2,9.25
AOUT7+  (via drill 0.3)
  Top 0.254: U2.19 21.3,8.1 v20.5,7.3
  InnerBottom 0.254: JP1.43 1.05,6.9 2.35,5.6 5,5.6 6.65,3.95 10.1,3.95 13.45,7.3 v20.5,7.3
AOUT7-  (via drill 0.3)
  Top 0.254: v20.5,8.25 20.85,8.6 U2.20
  InnerBottom 0.254: JP1.44 4.52,6.9 6.92,4.5 9.9,4.5 13.95,8.55 20.2,8.55 v20.5,8.25
AOUT8+  (via drill 0.3)
  Top 0.254: U2.17 21.9,7.1 v21.9,6.6
  InnerBottom 0.254: JP1.45 2.29,3.1 6,3.1 6.2,2.9 10.55,2.9 13.15,5.55 20.85,5.55 v21.9,6.6
AOUT8-  (via drill 0.3)
  Top 0.254: U2.18 21.65,7.6 v21.3,7.25
  InnerBottom 0.254: JP1.46 5.49,4.36 6.45,3.4 10.3,3.4 12.95,6.05 20.1,6.05 v21.3,7.25
BOOT  (via drill 0.3)
  Top 0.254: U1.94 24.31,35.1 | 24.31,35.1 R1.2 | 24.31,35.1 24.04,34.83 v24.04,34.2
  Bottom 0.254: v24.04,34.2 23.82,34.42 BOOT.2
DAC1  (via drill 0.3)
  Top 0.254: U1.29 8.75,36.6 v8.85,36.5
  InnerTop 0.254: JP1.9 2.3,51.35 4.65,51.35 5.25,50.75 5.25,37.2 5.85,36.6 8.75,36.6 v8.85,36.5
DAC2  (via drill 0.3)
  Top 0.254: v8.55,35.85 8.31,36.09 U1.30
  InnerTop 0.254: JP1.10 4.7,48.96 4.7,37 5.6,36.1 8.3,36.1 v8.55,35.85
DACREF
  Top 0.254: JP1.29 JP1.30 2.33,24.68 2.3,24.65 2.3,1.15 3.05,0.4 19.95,0.4 20.68,1.12 C31.+ 20.7,2.4 20.2,2.4 19.75,2.85 U2.15
EXTI1  (via drill 0.3)
  Top 0.254: U1.92 21.81,34.11 21.5,33.8 v21.5,32.9
  InnerTop 0.254: JP2.37 25.3,15.65 25.3,26.8 23.85,28.25 23.85,30.3 22.1,32.05 22.1,32.6 21.8,32.9 v21.5,32.9
EXTI2  (via drill 0.3)
  Top 0.254: U1.85 21.15,30.6 v20.85,30.6
  InnerTop 0.254: JP2.39 24.62,13.78 24.3,14.1 24.3,26.25 22.75,27.8 22.75,29.75 21.9,30.6 v20.85,30.6
EXTI3  (via drill 0.3)
  Top 0.254: v24.45,29.6 24.44,29.61 U1.83
  InnerBottom 0.254: JP2.41 27.7,10.71 27.7,20.25 v28.3,20.85
  Bottom 0.254: v28.3,20.85 27.7,21.45 27.7,22.5 28.3,23.1 28.3,23.65 27.7,24.25 27.7,27.8 27,28.5 25.55,28.5 v24.45,29.6
EXTI4  (via drill 0.3)
  Top 0.254: v20.85,28.85 21.14,28.59 U1.81
  InnerBottom 0.254: JP2.43 24.8,8.53 24.8,27.3 23.5,28.6 21.15,28.6 v20.85,28.85
EXTI5  (via drill 0.3)
  Top 0.254: v18.15,38.65 18,38.8 U1.7
  InnerTop 0.254: JP2.38 27.7,15.79 27.7,22.5 28.3,23.1 28.3,23.65 27.7,24.25 27.7,27.8 27,28.5 25.55,28.5 25.15,28.9 25.15,29.8 22.65,32.3 22.65,33.9 v21.45,35.1
  Bottom 0.254: v21.45,35.1 21.45,36 18.8,38.65 v18.15,38.65
EXTI6  (via drill 0.3)
  Top 0.254: U1.88 v21.5,32.1
  InnerTop 0.254: JP2.40 27.7,13.25 26.1,13.25 24.8,14.55 24.8,26.5 23.3,28 23.3,30 21.5,31.8 v21.5,32.1
EXTI7  (via drill 0.3)
  Top 0.254: U1.8 17.49,38.79 v17.35,38.65
  InnerTop 0.254: JP2.42 27.71,10.7 25.8,10.7 23.8,12.7 23.8,26 22.25,27.55 22.25,28.65 v21.5,29.4
  InnerBottom 0.254: v21.5,29.4 21.5,31 20.1,32.4 19.6,32.4 19.35,32.65 v18.1,32.65
  Bottom 0.254: v17.35,38.65 17.35,35.75 18.7,34.4 18.7,32.9 18.45,32.65 v18.1,32.65
EXTI8  (via drill 0.3)
  Top 0.254: v24.45,28.6 23.95,29.1 U1.82
  InnerBottom 0.254: JP2.44 27.67,8.2 26,8.2 25.3,8.9 25.3,27.75 v24.45,28.6
GND  (via drill 0.3)
  Top 0.254: C7.2 6.43,37.61 U1.27 8.21,37.61 v8.5,37.9 | U1.10 v16.5,38.65 | U2.11 17.75,6 18.35,6.6 20.9,6.6 21.55,5.95 22.79,5.95 v23.15,6.3 24,7.15 C36.2 | C13.2 5.93,28.33 v5.95,29.2 | 13.25,18.55 U2.47 | C37.2 13.25,18.55 | 7.9,19.75 9.1,20.95 9.1,21.4 | 9.1,21.4 9.1,22.55 7.9,23.75 C6.2 | 13.25,18.55 13.25,20.4 v12.25,21.4 9.1,21.4 | U1.74 20.52,23.48 v20.95,23.05 | 26.3,27.2 24.8,25.7 | CN1.G3 15,56.9 CN1.5 | U1.99 23.64,37.61 R1.1
  Top 0.305: C18.- 7.9,19.75
  InnerTop 0.254: v8.5,37.9 9.15,37.9 9.5,37.55 9.5,34.1 5.95,30.55 v5.95,29.2 5.95,25.6 6.7,24.85 v8.2,24.85
  InnerBottom 0.254: v12.25,21.4 12.25,22.05 12.65,22.45 | v20.95,23.05 20.95,22.6 21.95,21.55 v21.95,15.25
  Bottom 0.254: v12.25,21.4 12.25,22.05 12.65,22.45 | v23.15,6.3 23.8,6.96 23.8,14.7 23.45,15.05 22.15,15.05 v21.95,15.25
  other vias: 13.95,45.05 17.25,22.7 22.65,40.95 13.3,35.8 10.65,36.3 8.15,38.95 20.58,42.52 21.26,51.89 15.78,50.29 18.93,52.89 15.79,47.94 18.93,55.36 12.3,54.95 22.16,45.9 13.4,52.34 13.4,54.03 20.44,48.6 24.2,60.22
  pour Top: 8.2,62 30.5,62 30.5,0 24.4,0 24.4,22.4 8.65,22.4 7.3,23.75 7.3,39.75 13.2,39.75 13.2,54.3 8.2,54.3
  pour Bottom: 8.2,62 30.5,62 30.5,0 24.4,0 24.4,22.4 8.65,22.4 7.3,23.75 7.3,39.75 13.2,39.75 13.2,54.3 8.2,54.3
  pour InnerBottom: 8.2,62 30.5,62 30.5,0 24.4,0 24.4,22.4 8.65,22.4 7.3,23.75 7.3,39.75 13.2,39.75 13.2,54.3 8.2,54.3
I2C_SCL  (via drill 0.3)
  Top 0.254: U1.47 12.05,27.6 v12.2,27.75
  InnerBottom 0.254: JP2.45 26.43,5.02 25.3,6.15 25.3,7.25 24.3,8.25 24.3,27 23.55,27.75 v12.2,27.75
I2C_SDA  (via drill 0.3)
  Top 0.254: v12.6,27.1 11.55,27.1 U1.48
  InnerBottom 0.254: JP2.47 25.25,3 25.25,5.35 24.8,5.8 24.8,6.95 23.8,7.95 23.8,26.75 23.3,27.25 13.25,27.25 13.1,27.1 v12.6,27.1
N$2
  Top 0.254: U2.60 7.1,9.1 C28.+
N$11
  Top 0.254: U1.49 5.69,26.59 C13.1
N$12
  Top 0.254: C23.1 13.36,46.92 Y1.1 14.53,45.65 15.25,45.65 15.8,45.1 15.8,41.9 15,41.1 U1.13
N$15
  Top 0.254: C22.1 18.18,46.76 Y1.2 17.4,45.83 17.27,45.65 16.85,45.65 16.3,45.1 16.3,41.75 15.51,40.96 U1.12
N$17
  Top 0.254: U1.73 20.01,22.67 C14.1
NRST  (via drill 0.3)
  Top 0.254: C26.1 14.9,41.85 14.5,41.45 U1.14 14.5,38.75 v14.35,38.6
  Bottom 0.254: X1.5 22.3,43.84 22.3,44.4 21.2,45.5 15.3,45.5 14.5,44.7 14.5,38.75 v14.35,38.6
SAI_BCK  (via drill 0.3)
  Top 0.254: U1.4 19.5,38.35 18.65,37.5 15.55,37.5 14.8,36.75 14.8,33 v15.4,32.4 | U2.36 18.75,17.6 v18.3,18.05 | U2.7 15.75,4.45 16,4.15 v17,4.15
  InnerTop 0.254: v15.4,32.4 15.3,32.3 15.3,29.95 19,26.25 19,19.1 18.3,18.4 v18.3,18.05
  Bottom 0.254: v18.3,18.05 18.3,15.6 17.45,14.75 17.45,4.6 v17,4.15
SAI_LRCK  (via drill 0.3)
  Top 0.254: U1.3 20.01,38.11 18.9,37 15.75,37 15.4,36.65 v15.4,33.35 | U2.35 19.25,18.05 v19.05,18.25 | U2.6 15.25,4.15 15.85,3.55 17.25,3.55 17.8,4.1 v18.05,4.1
  InnerTop 0.254: v15.4,33.35 16.5,32.25 16.5,29.5 19.5,26.5 19.5,18.7 v19.05,18.25
  Bottom 0.254: v19.05,18.25 19.05,15.55 18.05,14.55 v18.05,4.1
SAI_MCLK  (via drill 0.3)
  Top 0.254: U1.1 21,38.95 21,37.6 19.45,36 17.3,36 16.5,35.2 16.5,30.2 16.45,30.15 16.45,26.75 v16.55,26.65 | U2.41 16.25,17.35 v16.5,17.6
  InnerTop 0.254: v16.5,17.6 16.5,18.1 18,19.6 18,25.2 v16.55,26.65
SAI_SDI  (via drill 0.3)
  Top 0.254: U1.5 18.99,38.59 18.4,38 13.4,38 12.65,37.2 v12.65,34.05 | U2.8 v16.25,6.65
  InnerTop 0.254: v16.25,15.5 16.25,15.8 15.45,16.6 12,16.6 9.9,18.7 9.9,22.65 12.75,25.5 13.45,25.5 14.25,26.3 14.25,32.95 13.15,34.05 v12.65,34.05
  Bottom 0.254: v16.25,6.65 v16.25,15.5
SAI_SDO  (via drill 0.3)
  Top 0.254: U1.2 20.52,37.82 19.2,36.5 16.2,36.5 v16,36.3 | U2.37 18.25,17.15 v17.65,17.75
  InnerTop 0.254: v17.65,17.75 17.65,18.5 18.5,19.35 18.5,26 14.8,29.7 14.8,35.1 v16,36.3
SPI3_MISO  (via drill 0.3)
  Top 0.254: U1.79 20.4,27.6 19.7,28.3 19.7,34.4 20.2,34.9 v20.2,35.7
  InnerTop 0.254: JP2.16 27.7,41.2 27.7,39.1 27.25,38.65 26,38.65 23.05,35.7 v20.2,35.7
SPI3_MOSI  (via drill 0.3)
  Top 0.254: U1.80 20.69,28.11 20.25,28.55 20.25,34.1 v20.3,34.15
  InnerBottom 0.254: JP2.18 27.7,38.65 26,38.65 23.05,35.7 21.15,35.7 20.3,34.85 v20.3,34.15
SPI3_SCK  (via drill 0.3)
  Top 0.254: U1.78 20.15,27.1 19.2,28.05 19.2,34.6 19.55,34.95 v19.55,35.25
  InnerTop 0.254: JP2.14 27.7,43.73 27.7,42 26.9,41.2 25.95,41.2 25.25,40.5 25.25,38.75 22.85,36.35 19.9,36.35 19.55,36 v19.55,35.25
SPI4_MISO  (via drill 0.3)
  Top 0.254: U1.44 11.75,29.1 v12.2,29.55
  InnerBottom 0.254: JP2.15 25.25,41.28 25.25,39.5 22.7,36.95 19,36.95 17,34.95 17,30.25 16.3,29.55 v12.2,29.55
SPI4_MOSI  (via drill 0.3)
  Top 0.254: U1.45 11.65,28.59 v11.85,28.4
  InnerBottom 0.254: JP2.17 22.96,36.45 19.2,36.45 17.5,34.75 17.5,29.5 16.95,28.95 12.4,28.95 v11.85,28.4
SPI4_SCK  (via drill 0.3)
  Top 0.254: U1.43 11.26,29.61 v11.85,30.2
  InnerBottom 0.254: JP2.13 25.3,43.87 25.3,42 24.75,41.45 24.75,39.7 22.55,37.5 18.8,37.5 16.5,35.2 16.5,30.55 16.15,30.2 v11.85,30.2
SWCLK  (via drill 0.3)
  Top 0.254: U1.76 20.34,26.11 17.95,28.5 17.95,29.1 v18.1,29.25
  InnerTop 0.254: v18.1,29.25 17,30.35 17,36.55 16.65,36.9 15.65,36.9 15.55,36.8 v14.1,36.8
  Bottom 0.254: X1.2 18.57,42.92 18.25,42.6 16.05,42.6 15.5,42.05 15.5,37.45 14.85,36.8 v14.1,36.8
SWDIO  (via drill 0.3)
  Top 0.254: U1.72 19.5,26.1 17.45,28.15 17.45,29.45 v18.1,30.1
  InnerTop 0.254: v18.1,30.1 17.5,30.7 17.5,36.8 16.9,37.4 v14.55,37.4
  Bottom 0.254: X1.4 21.07,44.28 20.35,45 15.6,45 15,44.4 15,37.85 v14.55,37.4
TIM1_CH1
  Top 0.254: U1.90 25.64,33.09 JP2.23
TIM1_CH2  (via drill 0.3)
  Top 0.254: U1.91 27.1,33.6 v27.7,33.6
  InnerBottom 0.254: v27.7,33.6 27.67,33.6 JP2.24
TIM2_CH1
  Top 0.254: U1.77 24.74,26.59 25.1,26.95 25.1,28.43 JP2.25
TIM2_CH2  (via drill 0.3)
  Top 0.254: U1.89 24.34,32.61 25.95,31 v27.05,31
  InnerBottom 0.254: v27.05,31 27.73,31 JP2.26
TIM3_CH1  (via drill 0.3)
  Top 0.254: U1.40 10.94,31.11 11.25,31.4 11.4,31.55 v11.85,31.55 | JP2.29 24.5,22.75 v22.45,22.75
  InnerBottom 0.254: v22.45,22.75 22.45,23.55 22.7,23.8 22.7,25.75 22.45,26 17.65,26 17.05,25.4 12.65,25.4 10.65,27.4 10.65,30.8 11.4,31.55 v11.85,31.55
TIM3_CH2  (via drill 0.3)
  Top 0.254: U1.42 10.64,30.09 11.45,30.9 v12.25,30.9 | JP2.30 27.75,25.9 25.9,25.9 25.2,25.2 25.2,24.2 24.35,23.35 v23.2,23.35
  InnerBottom 0.254: v12.25,30.9 11.55,30.9 11.15,30.5 11.15,27.65 12.9,25.9 16.85,25.9 17.45,26.5 22.7,26.5 23.2,26 v23.2,23.35
TIM4_CH1
  Top 0.254: U1.59 13,22.85 14.6,21.25 20.75,21.25 21.1,21.6 24.75,21.6 25.3,22.15 JP2.31
TIM4_CH2
  Top 0.254: U1.60 13.51,23.04 14.8,21.75 20.55,21.75 20.9,22.1 24.55,22.1 25.9,23.45 26.9,23.45 27.45,24 27.95,24 28.97,22.98 JP2.32
TIM5_CH1  (via drill 0.3)
  Top 0.254: U1.23 10,34.25 11.3,32.95 11.3,32.4 v10.65,31.75
  Bottom 0.254: JP2.33 24.8,21.23 24.8,24.65 24.45,25 12.3,25 10.65,26.65 v10.65,31.75
TIM5_CH2  (via drill 0.3)
  Top 0.254: v10.7,32.7 9.5,33.9 U1.24
  Bottom 0.254: JP2.34 28.15,19.6 27.9,19.85 26.92,20.85 25.95,20.85 25.3,21.5 25.3,24.85 24.65,25.5 12.55,25.5 11.25,26.8 11.25,32.15 v10.7,32.7
TIM6_CH1  (via drill 0.3)
  Top 0.254: v14.85,22.75 15,22.95 U1.63
  Bottom 0.254: v14.85,22.75 14.85,22.7 15.95,21.6 23.45,21.6 23.8,21.25 23.8,19.69 JP2.35
TIM6_CH2  (via drill 0.3)
  Top 0.254: U1.64 15.51,22.94 v15.65,22.8
  Bottom 0.254: v15.65,22.8 16.35,22.1 23.7,22.1 24.3,21.5 24.3,20 25.9,18.35 27.68,18.35 JP2.36
UART1_RX  (via drill 0.3)
  Top 0.254: U1.87 23.59,31.59 v24,32
  InnerBottom 0.254: v24,32 24,32.45 24.55,33 JP2.21
UART1_TX  (via drill 0.3)
  Top 0.254: v20.9,34.6 20.9,31.6 21.39,31.11 U1.86
  InnerBottom 0.254: v20.9,34.6 21,34.5 22.65,34.5 25.53,37.38 JP2.19
UART2_RX  (via drill 0.3)
  Top 0.254: U1.56 11.5,23.55 v11.9,22.85
  InnerBottom 0.254: JP2.22 28.09,34.84 26.85,33.6 25.9,33.6 24.6,32.3 24.6,31.7 24.2,31.3 23.65,31.3 23.35,31.6 23.35,32.95 22.8,33.5 21.25,33.5 20.8,33.05 19.7,33.05 19.35,33.4 v18.1,33.4
  Bottom 0.254: v11.9,22.85 11.5,23.55 11.5,25.1 9.25,27.35 9.25,32.3 11.6,34.65 16.05,34.65 17.3,33.4 v18.1,33.4
UART2_TX  (via drill 0.3)
  Top 0.254: U1.55 11.02,22.98 v11.15,22.85
  InnerBottom 0.254: JP2.20 27.69,36.1 25,36.1 22.9,34 21.05,34 20.6,33.55 20,33.55 19.4,34.15 v18.1,34.15
  Bottom 0.254: v11.15,22.85 11,23 11,24.95 8.7,27.25 8.7,32.5 11.35,35.15 16.4,35.15 17.4,34.15 v18.1,34.15
USBD_D+  (via drill 0.3)
  Top 0.254: U1.71 18.99,25.91 16.95,27.9 16.95,29.8 v18.1,30.95 | CN1.3 v13.7,55.75
  InnerTop 0.254: JP2.7 27.7,51.35 27.7,49.6 26.9,48.8 26,48.8 25.3,48.1 25.3,43.8 24.8,43.3 24.8,42.3 24.25,41.75 24.25,39.2 22.4,37.35 19.4,37.35 18.2,36.15 18.2,34.9 18.7,34.4 18.7,31.55 v18.1,30.95
  InnerBottom 0.254: v13.7,55.75 13.75,55.75 15.65,53.85 25.2,53.85 JP2.7
USBD_D-  (via drill 0.3)
  Top 0.254: U1.70 18.51,25.54 18,26.05 16.25,26.05 15.95,26.35 15.95,28.85 15.9,28.9 v15.9,30.95 | CN1.2 13.05,56.1 v12.7,55.75
  InnerTop 0.254: JP2.5 24.7,53.43 24.7,49.35 24.3,48.95 24.3,46.55 v24.1,46.35
  InnerBottom 0.254: v12.7,55.75 13.3,56.35 14.15,56.35 16.15,54.35 25.62,54.35 JP2.5 | v15.9,30.95 14.8,32.05 14.8,35.25 v13.4,36.65
  Bottom 0.254: v24.1,46.35 24.1,46.9 23.8,47.2 14.05,47.2 12.85,45.95 12.85,37.2 v13.4,36.65
USBD_ID  (via drill 0.3)
  Top 0.254: U1.69 18,25.3 17.75,25.55 16,25.55 15.45,26.1 15.45,28.65 15.3,28.8 15.3,31.2 v15.9,31.8 | CN1.4 14.35,56.15 14.75,55.75 17.18,55.75 18.62,57.2 v25,57.2
  InnerBottom 0.254: v25,57.2 25.8,56.4 27.1,56.4 27.7,55.8 27.7,51.35 JP2.9 25.25,48.9 25.25,44.75 24.8,44.3 24.8,42.3 24.25,41.75 24.25,40.05 23.45,39.25 22.55,39.25 21.35,38.05 18.65,38.05 16,35.4 16,31.9 v15.9,31.8
USBD_VBUS  (via drill 0.3)
  Top 0.254: CN1.1 12.4,58.2 12.56,58.36 25.77,58.36 JP2.3 | v14.1,34 14.1,29.35 14.85,28.6 v14.85,26.55 | U1.68 17.49,23.49 17.3,23.3 16.8,23.3 v16.55,23.05
  InnerTop 0.254: v14.85,26.55 16.55,24.85 v16.55,23.05
  Bottom 0.254: JP2.3 25.25,56.52 25.25,37.9 23.95,36.6 23.15,36.6 22.55,36 22.55,34.35 22.2,34 21.05,34 19.1,32.05 17.8,32.05 15.85,34 v14.1,34
USBH_D+  (via drill 0.3)
  Top 0.254: U1.54 10.51,22.96 v10.5,22.3
  InnerTop 0.254: JP2.8 27.69,53.9 26.15,53.9 25.25,53 25.25,49.1 24.8,48.65 24.8,44.05 24.3,43.55 24.3,42.55 23.75,42 23.75,40.45 21.3,38 v11.2,38
  Bottom 0.254: v10.5,22.3 10.5,24.75 8.15,27.1 8.15,32.75 9.5,34.1 9.5,37.3 10.2,38 v11.2,38
USBH_D-  (via drill 0.3)
  Top 0.254: U1.53 10,25.35 10.15,25.5 13.45,25.5 14.25,26.3 14.25,28.4 13.4,29.25 13.4,31.7 12.8,32.3 v11.95,32.3
  InnerTop 0.254: JP2.6 27.68,56.45 26.15,56.45 24.2,54.5 24.2,49.6 23.8,49.2 23.8,47.15 v23.25,46.6 | v11.95,32.3 11.3,32.95 11.3,36.55 12.15,37.4 v13.7,37.4
  Bottom 0.254: v23.25,46.6 23.2,46.65 14.25,46.65 13.35,45.75 13.35,37.75 v13.7,37.4
USBH_ID  (via drill 0.3)
  Top 0.254: U1.51 9.01,25.86 9.65,26.5 12.95,26.5 13.25,26.8 13.25,27.75 v12.65,28.35 | v18.6,28.7 18.7,28.85 18.7,34.8 18.8,34.9 v18.8,35.2
  InnerTop 0.254: JP2.10 27.7,48.81 27.7,44.55 26.9,43.75 26.05,43.75 25.3,43 25.3,42 24.75,41.45 24.75,39 22.6,36.85 19.65,36.85 18.8,36 v18.8,35.2
  InnerBottom 0.254: v12.65,28.35 18.25,28.35 v18.6,28.7
USBH_VBUS  (via drill 0.3)
  Top 0.254: U1.52 9.49,25.59 9.9,26 13.2,26 13.75,26.55 13.75,28.15 12.85,29.05 12.85,31.35 v12.65,31.55
  Bottom 0.254: JP2.4 27.7,56.43 27.7,36.55 27.25,36.1 23.35,36.1 23.05,35.8 23.05,34.15 22.4,33.5 21.25,33.5 19.75,31.95 19.3,31.55 17.5,31.55 16.15,30.2 14,30.2 v12.65,31.55
VREF_ADC
  Top 0.254: U2.59 8.5,9.6 7.95,10.15 7.5,10.15 7.35,10.3 7.35,10.8 C29.+

### Text on the board
bPlace: 2 1 | 96 95 | 3 | 94 | 5 | 92 | 7 | 90 | 9 | 88 | 11 | 86 | 13 | 84 | 15 | 82 | 17 | 80 | 19 | 78 | 21 | 23 | 74 | 25 | 72 | 27 | 70 | 29 | 68 | 31 | 66 | 33 | 64 | Noctua Rev02 | 35 | 62 | 37 | 60 | 39 | 58 | 41 | 56 | 43 | 54 | 45 | 52 | 48 47 | 50 49